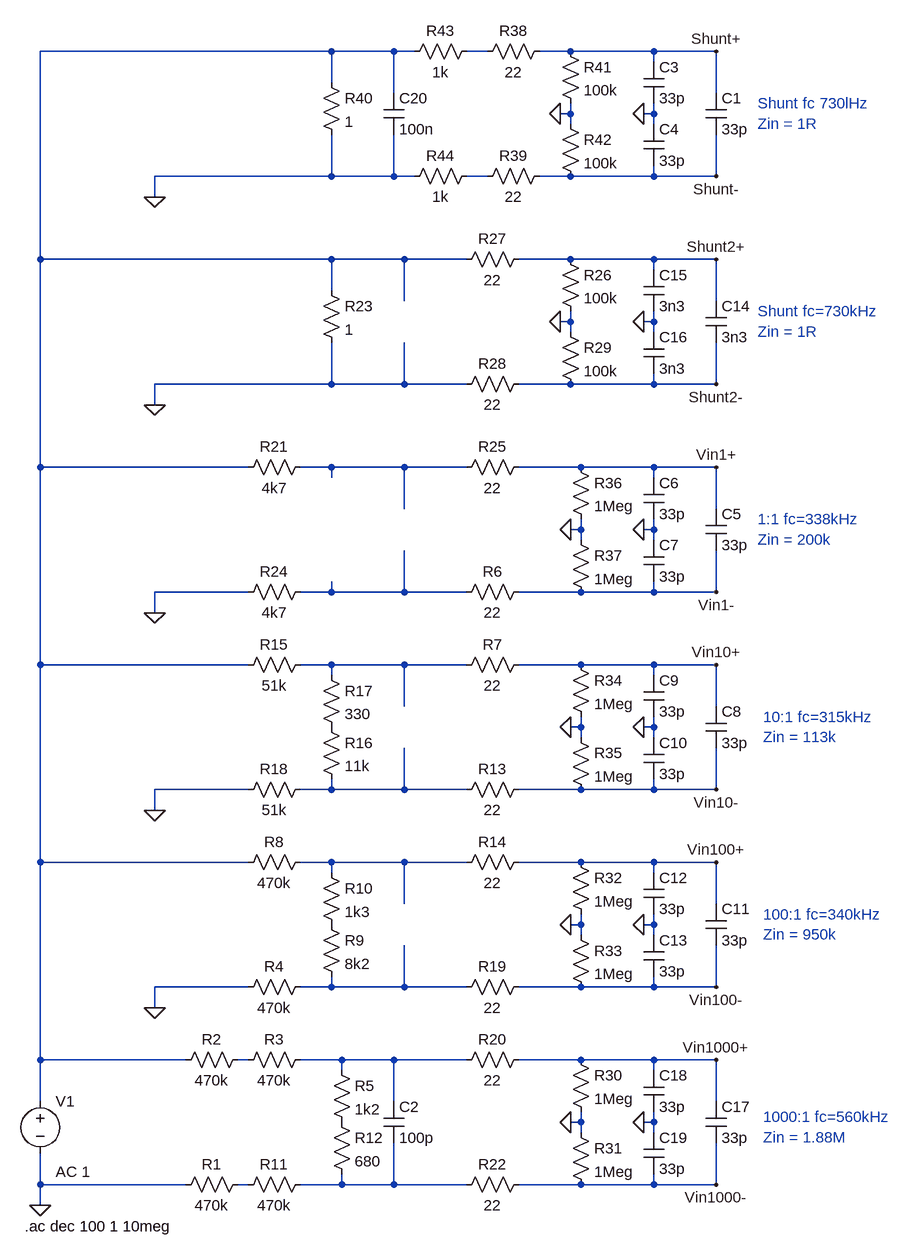
[diagram p0: schematic Input Divider.asc]
Input Divider.asc, the LTspice schematic file:
Version 4.1
SHEET 1 1476 680
WIRE 592 -1472 144 -1472
WIRE 688 -1472 592 -1472
WIRE 720 -1472 688 -1472
WIRE 832 -1472 800 -1472
WIRE 960 -1472 912 -1472
WIRE 1088 -1472 960 -1472
WIRE 1184 -1472 1088 -1472
WIRE 1088 -1456 1088 -1472
WIRE 592 -1424 592 -1472
WIRE 688 -1408 688 -1472
WIRE 1184 -1408 1184 -1472
WIRE 960 -1376 960 -1392
WIRE 960 -1376 944 -1376
WIRE 1088 -1376 1088 -1392
WIRE 1088 -1376 1072 -1376
WIRE 960 -1360 960 -1376
WIRE 1088 -1360 1088 -1376
WIRE 592 -1280 592 -1344
WIRE 592 -1280 320 -1280
WIRE 688 -1280 688 -1344
WIRE 688 -1280 592 -1280
WIRE 720 -1280 688 -1280
WIRE 832 -1280 800 -1280
WIRE 960 -1280 912 -1280
WIRE 1088 -1280 1088 -1296
WIRE 1088 -1280 960 -1280
WIRE 1184 -1280 1184 -1344
WIRE 1184 -1280 1088 -1280
WIRE 320 -1248 320 -1280
WIRE 144 -1152 144 -1472
WIRE 592 -1152 144 -1152
WIRE 704 -1152 592 -1152
WIRE 800 -1152 704 -1152
WIRE 960 -1152 880 -1152
WIRE 1088 -1152 960 -1152
WIRE 1184 -1152 1088 -1152
WIRE 1088 -1136 1088 -1152
WIRE 592 -1104 592 -1152
WIRE 704 -1088 704 -1152
WIRE 1184 -1088 1184 -1152
WIRE 960 -1056 960 -1072
WIRE 960 -1056 944 -1056
WIRE 1088 -1056 1088 -1072
WIRE 1088 -1056 1072 -1056
WIRE 960 -1040 960 -1056
WIRE 1088 -1040 1088 -1056
WIRE 592 -960 592 -1024
WIRE 592 -960 320 -960
WIRE 704 -960 704 -1024
WIRE 704 -960 592 -960
WIRE 800 -960 704 -960
WIRE 960 -960 880 -960
WIRE 1088 -960 1088 -976
WIRE 1088 -960 960 -960
WIRE 1184 -960 1184 -1024
WIRE 1184 -960 1088 -960
WIRE 320 -928 320 -960
WIRE 144 -832 144 -1152
WIRE 464 -832 144 -832
WIRE 592 -832 544 -832
WIRE 704 -832 592 -832
WIRE 800 -832 704 -832
WIRE 976 -832 880 -832
WIRE 1088 -832 976 -832
WIRE 1184 -832 1088 -832
WIRE 592 -816 592 -832
WIRE 1088 -816 1088 -832
WIRE 704 -768 704 -832
WIRE 1184 -768 1184 -832
WIRE 976 -736 976 -752
WIRE 976 -736 960 -736
WIRE 1088 -736 1088 -752
WIRE 1088 -736 1072 -736
WIRE 976 -720 976 -736
WIRE 1088 -720 1088 -736
WIRE 464 -640 320 -640
WIRE 592 -640 592 -656
WIRE 592 -640 544 -640
WIRE 704 -640 704 -704
WIRE 704 -640 592 -640
WIRE 800 -640 704 -640
WIRE 976 -640 880 -640
WIRE 1088 -640 1088 -656
WIRE 1088 -640 976 -640
WIRE 1184 -640 1184 -704
WIRE 1184 -640 1088 -640
WIRE 320 -608 320 -640
WIRE 144 -528 144 -832
WIRE 464 -528 144 -528
WIRE 592 -528 544 -528
WIRE 704 -528 592 -528
WIRE 800 -528 704 -528
WIRE 976 -528 880 -528
WIRE 1088 -528 976 -528
WIRE 1184 -528 1088 -528
WIRE 592 -512 592 -528
WIRE 1088 -512 1088 -528
WIRE 704 -464 704 -528
WIRE 1184 -464 1184 -528
WIRE 976 -432 976 -448
WIRE 976 -432 960 -432
WIRE 1088 -432 1088 -448
WIRE 1088 -432 1072 -432
WIRE 976 -416 976 -432
WIRE 1088 -416 1088 -432
WIRE 464 -336 320 -336
WIRE 592 -336 592 -352
WIRE 592 -336 544 -336
WIRE 704 -336 704 -400
WIRE 704 -336 592 -336
WIRE 800 -336 704 -336
WIRE 976 -336 880 -336
WIRE 1088 -336 1088 -352
WIRE 1088 -336 976 -336
WIRE 1184 -336 1184 -400
WIRE 1184 -336 1088 -336
WIRE 320 -304 320 -336
WIRE 144 -224 144 -528
WIRE 464 -224 144 -224
WIRE 592 -224 544 -224
WIRE 704 -224 592 -224
WIRE 800 -224 704 -224
WIRE 976 -224 880 -224
WIRE 1088 -224 976 -224
WIRE 1184 -224 1088 -224
WIRE 592 -208 592 -224
WIRE 1088 -208 1088 -224
WIRE 704 -160 704 -224
WIRE 1184 -160 1184 -224
WIRE 976 -128 976 -144
WIRE 976 -128 960 -128
WIRE 1088 -128 1088 -144
WIRE 1088 -128 1072 -128
WIRE 976 -112 976 -128
WIRE 1088 -112 1088 -128
WIRE 464 -32 320 -32
WIRE 592 -32 592 -48
WIRE 592 -32 544 -32
WIRE 704 -32 704 -96
WIRE 704 -32 592 -32
WIRE 800 -32 704 -32
WIRE 976 -32 880 -32
WIRE 1088 -32 1088 -48
WIRE 1088 -32 976 -32
WIRE 1184 -32 1184 -96
WIRE 1184 -32 1088 -32
WIRE 320 0 320 -32
WIRE 144 80 144 -224
WIRE 368 80 144 80
WIRE 464 80 448 80
WIRE 608 80 544 80
WIRE 688 80 608 80
WIRE 800 80 688 80
WIRE 976 80 880 80
WIRE 1088 80 976 80
WIRE 1184 80 1088 80
WIRE 608 96 608 80
WIRE 1088 96 1088 80
WIRE 144 144 144 80
WIRE 688 144 688 80
WIRE 1184 144 1184 80
WIRE 976 176 976 160
WIRE 976 176 960 176
WIRE 1088 176 1088 160
WIRE 1088 176 1072 176
WIRE 976 192 976 176
WIRE 1088 192 1088 176
WIRE 144 272 144 224
WIRE 368 272 144 272
WIRE 464 272 448 272
WIRE 608 272 608 256
WIRE 608 272 544 272
WIRE 688 272 688 208
WIRE 688 272 608 272
WIRE 800 272 688 272
WIRE 976 272 880 272
WIRE 1088 272 1088 256
WIRE 1088 272 976 272
WIRE 1184 272 1184 208
WIRE 1184 272 1088 272
WIRE 144 304 144 272
FLAG 144 304 0
FLAG 1184 80 Vin1000+
FLAG 1184 272 Vin1000-
FLAG 320 0 0
FLAG 1184 -224 Vin100+
FLAG 1184 -32 Vin100-
FLAG 320 -304 0
FLAG 1184 -528 Vin10+
FLAG 1184 -336 Vin10-
FLAG 320 -608 0
FLAG 1184 -832 Vin1+
FLAG 1184 -640 Vin1-
FLAG 320 -928 0
FLAG 1184 -1152 Shunt2+
FLAG 1184 -960 Shunt2-
FLAG 1072 -1056 0
FLAG 944 -1056 0
FLAG 960 176 0
FLAG 960 -128 0
FLAG 960 -432 0
FLAG 960 -736 0
FLAG 320 -1248 0
FLAG 1184 -1472 Shunt+
FLAG 1184 -1280 Shunt-
FLAG 1072 -1376 0
FLAG 944 -1376 0
FLAG 1072 -736 0
FLAG 1072 -432 0
FLAG 1072 -128 0
FLAG 1072 176 0
SYMBOL voltage 144 128 R0
WINDOW 123 24 124 Left 2
WINDOW 39 0 0 Left 0
SYMATTR Value2 AC 1
SYMATTR InstName V1
SYMATTR Value ""
SYMBOL res 464 64 R90
WINDOW 0 0 56 VBottom 2
WINDOW 3 32 56 VTop 2
SYMATTR InstName R2
SYMATTR Value 470k
SYMBOL res 560 64 R90
WINDOW 0 0 56 VBottom 2
WINDOW 3 32 56 VTop 2
SYMATTR InstName R3
SYMATTR Value 470k
SYMBOL res 560 -240 R90
WINDOW 0 0 56 VBottom 2
WINDOW 3 32 56 VTop 2
SYMATTR InstName R8
SYMATTR Value 470k
SYMBOL res 576 -144 R0
SYMATTR InstName R9
SYMATTR Value 8k2
SYMBOL res 576 -224 R0
SYMATTR InstName R10
SYMATTR Value 1k3
SYMBOL cap 672 144 R0
SYMATTR InstName C2
SYMATTR Value 100p
SYMBOL res 464 256 R90
WINDOW 0 0 56 VBottom 2
WINDOW 3 32 56 VTop 2
SYMATTR InstName R1
SYMATTR Value 470k
SYMBOL res 560 256 R90
WINDOW 0 0 56 VBottom 2
WINDOW 3 32 56 VTop 2
SYMATTR InstName R11
SYMATTR Value 470k
SYMBOL res 560 -48 R90
WINDOW 0 0 56 VBottom 2
WINDOW 3 32 56 VTop 2
SYMATTR InstName R4
SYMATTR Value 470k
SYMBOL res 592 80 R0
SYMATTR InstName R5
SYMATTR Value 1k2
SYMBOL res 592 160 R0
SYMATTR InstName R12
SYMATTR Value 680
SYMBOL res 560 -544 R90
WINDOW 0 0 56 VBottom 2
WINDOW 3 32 56 VTop 2
SYMATTR InstName R15
SYMATTR Value 51k
SYMBOL res 576 -448 R0
SYMATTR InstName R16
SYMATTR Value 11k
SYMBOL res 576 -528 R0
SYMATTR InstName R17
SYMATTR Value 330
SYMBOL res 560 -352 R90
WINDOW 0 0 56 VBottom 2
WINDOW 3 32 56 VTop 2
SYMATTR InstName R18
SYMATTR Value 51k
SYMBOL res 560 -848 R90
WINDOW 0 0 56 VBottom 2
WINDOW 3 32 56 VTop 2
SYMATTR InstName R21
SYMATTR Value 4k7
SYMBOL res 560 -656 R90
WINDOW 0 0 56 VBottom 2
WINDOW 3 32 56 VTop 2
SYMATTR InstName R24
SYMATTR Value 4k7
SYMBOL res 896 -848 R90
WINDOW 0 0 56 VBottom 2
WINDOW 3 32 56 VTop 2
SYMATTR InstName R25
SYMATTR Value 22
SYMBOL res 896 -656 R90
WINDOW 0 0 56 VBottom 2
WINDOW 3 32 56 VTop 2
SYMATTR InstName R6
SYMATTR Value 22
SYMBOL res 896 -544 R90
WINDOW 0 0 56 VBottom 2
WINDOW 3 32 56 VTop 2
SYMATTR InstName R7
SYMATTR Value 22
SYMBOL res 896 -352 R90
WINDOW 0 0 56 VBottom 2
WINDOW 3 32 56 VTop 2
SYMATTR InstName R13
SYMATTR Value 22
SYMBOL res 896 -240 R90
WINDOW 0 0 56 VBottom 2
WINDOW 3 32 56 VTop 2
SYMATTR InstName R14
SYMATTR Value 22
SYMBOL res 896 -48 R90
WINDOW 0 0 56 VBottom 2
WINDOW 3 32 56 VTop 2
SYMATTR InstName R19
SYMATTR Value 22
SYMBOL res 896 64 R90
WINDOW 0 0 56 VBottom 2
WINDOW 3 32 56 VTop 2
SYMATTR InstName R20
SYMATTR Value 22
SYMBOL res 896 256 R90
WINDOW 0 0 56 VBottom 2
WINDOW 3 32 56 VTop 2
SYMATTR InstName R22
SYMATTR Value 22
SYMBOL cap 1168 -1088 R0
SYMATTR InstName C14
SYMATTR Value 3n3
SYMBOL res 896 -1168 R90
WINDOW 0 0 56 VBottom 2
WINDOW 3 32 56 VTop 2
SYMATTR InstName R27
SYMATTR Value 22
SYMBOL res 896 -976 R90
WINDOW 0 0 56 VBottom 2
WINDOW 3 32 56 VTop 2
SYMATTR InstName R28
SYMATTR Value 22
SYMBOL cap 1072 -1136 R0
SYMATTR InstName C15
SYMATTR Value 3n3
SYMBOL cap 1072 -1040 R0
SYMATTR InstName C16
SYMATTR Value 3n3
SYMBOL res 576 -1120 R0
SYMATTR InstName R23
SYMATTR Value 1
SYMBOL res 944 -1168 R0
SYMATTR InstName R26
SYMATTR Value 100k
SYMBOL res 944 -1056 R0
SYMATTR InstName R29
SYMATTR Value 100k
SYMBOL res 960 64 R0
SYMATTR InstName R30
SYMATTR Value 1Meg
SYMBOL res 960 176 R0
SYMATTR InstName R31
SYMATTR Value 1Meg
SYMBOL res 960 -240 R0
SYMATTR InstName R32
SYMATTR Value 1Meg
SYMBOL res 960 -128 R0
SYMATTR InstName R33
SYMATTR Value 1Meg
SYMBOL res 960 -544 R0
SYMATTR InstName R34
SYMATTR Value 1Meg
SYMBOL res 960 -432 R0
SYMATTR InstName R35
SYMATTR Value 1Meg
SYMBOL res 960 -848 R0
SYMATTR InstName R36
SYMATTR Value 1Meg
SYMBOL res 960 -736 R0
SYMATTR InstName R37
SYMATTR Value 1Meg
SYMBOL res 928 -1488 R90
WINDOW 0 0 56 VBottom 2
WINDOW 3 32 56 VTop 2
SYMATTR InstName R38
SYMATTR Value 22
SYMBOL res 928 -1296 R90
WINDOW 0 0 56 VBottom 2
WINDOW 3 32 56 VTop 2
SYMATTR InstName R39
SYMATTR Value 22
SYMBOL res 576 -1440 R0
SYMATTR InstName R40
SYMATTR Value 1
SYMBOL res 944 -1488 R0
SYMATTR InstName R41
SYMATTR Value 100k
SYMBOL res 944 -1376 R0
SYMATTR InstName R42
SYMATTR Value 100k
SYMBOL cap 672 -1408 R0
SYMATTR InstName C20
SYMATTR Value 100n
SYMBOL cap 1168 -1408 R0
SYMATTR InstName C1
SYMATTR Value 33p
SYMBOL cap 1072 -1456 R0
SYMATTR InstName C3
SYMATTR Value 33p
SYMBOL cap 1072 -1360 R0
SYMATTR InstName C4
SYMATTR Value 33p
SYMBOL cap 1168 -768 R0
SYMATTR InstName C5
SYMATTR Value 33p
SYMBOL cap 1072 -816 R0
SYMATTR InstName C6
SYMATTR Value 33p
SYMBOL cap 1072 -720 R0
SYMATTR InstName C7
SYMATTR Value 33p
SYMBOL cap 1168 -464 R0
SYMATTR InstName C8
SYMATTR Value 33p
SYMBOL cap 1072 -512 R0
SYMATTR InstName C9
SYMATTR Value 33p
SYMBOL cap 1072 -416 R0
SYMATTR InstName C10
SYMATTR Value 33p
SYMBOL cap 1168 -160 R0
SYMATTR InstName C11
SYMATTR Value 33p
SYMBOL cap 1072 -208 R0
SYMATTR InstName C12
SYMATTR Value 33p
SYMBOL cap 1072 -112 R0
SYMATTR InstName C13
SYMATTR Value 33p
SYMBOL cap 1168 144 R0
SYMATTR InstName C17
SYMATTR Value 33p
SYMBOL cap 1072 96 R0
SYMATTR InstName C18
SYMATTR Value 33p
SYMBOL cap 1072 192 R0
SYMATTR InstName C19
SYMATTR Value 33p
SYMBOL res 816 -1488 R90
WINDOW 0 0 56 VBottom 2
WINDOW 3 32 56 VTop 2
SYMATTR InstName R43
SYMATTR Value 1k
SYMBOL res 816 -1296 R90
WINDOW 0 0 56 VBottom 2
WINDOW 3 32 56 VTop 2
SYMATTR InstName R44
SYMATTR Value 1k
TEXT 120 336 Left 2 !.ac dec 100 1 10meg
TEXT 1256 168 Left 2 ;1000:1 fc=560kHz\nZin = 1.88M
TEXT 1256 -144 Left 2 ;100:1 fc=340kHz\nZin = 950k
TEXT 1256 -448 Left 2 ;10:1 fc=315kHz\nZin = 113k
TEXT 1248 -752 Left 2 ;1:1 fc=338kHz\nZin = 200k
TEXT 1248 -1072 Left 2 ;Shunt fc=730kHz\nZin = 1R
TEXT 1248 -1392 Left 2 ;Shunt fc 730lHz\nZin = 1R

The netlist it stands for:
* Input Divider.asc
V1 N001 0 AC 1
R2 N010 N001 470k
R3 N011 N010 470k
R8 N008 N001 470k
R9 P001 N009 8k2
R10 N008 P001 1k3
C2 N011 N013 100p
R1 N012 0 470k
R11 N013 N012 470k
R4 N009 0 470k
R5 N011 P002 1k2
R12 P002 N013 680
R15 N006 N001 51k
R16 P003 N007 11k
R17 N006 P003 330
R18 N007 0 51k
R21 N004 N001 4k7
R24 N005 0 4k7
R25 Vin1+ N004 22
R6 Vin1- N005 22
R7 Vin10+ N006 22
R13 Vin10- N007 22
R14 Vin100+ N008 22
R19 Vin100- N009 22
R20 Vin1000+ N011 22
R22 Vin1000- N013 22
C14 Shunt2+ Shunt2- 3n3
R27 Shunt2+ N001 22
R28 Shunt2- 0 22
C15 Shunt2+ 0 3n3
C16 0 Shunt2- 3n3
R23 N001 0 1
R26 Shunt2+ 0 100k
R29 0 Shunt2- 100k
R30 Vin1000+ 0 1Meg
R31 0 Vin1000- 1Meg
R32 Vin100+ 0 1Meg
R33 0 Vin100- 1Meg
R34 Vin10+ 0 1Meg
R35 0 Vin10- 1Meg
R36 Vin1+ 0 1Meg
R37 0 Vin1- 1Meg
R38 Shunt+ N002 22
R39 Shunt- N003 22
R40 N001 0 1
R41 Shunt+ 0 100k
R42 0 Shunt- 100k
C20 N001 0 100n
C1 Shunt+ Shunt- 33p
C3 Shunt+ 0 33p
C4 0 Shunt- 33p
C5 Vin1+ Vin1- 33p
C6 Vin1+ 0 33p
C7 0 Vin1- 33p
C8 Vin10+ Vin10- 33p
C9 Vin10+ 0 33p
C10 0 Vin10- 33p
C11 Vin100+ Vin100- 33p
C12 Vin100+ 0 33p
C13 0 Vin100- 33p
C17 Vin1000+ Vin1000- 33p
C18 Vin1000+ 0 33p
C19 0 Vin1000- 33p
R43 N002 N001 1k
R44 N003 0 1k
.ac dec 100 1 10meg
* 1000:1 fc=560kHz
* Zin = 1.88M
* 100:1 fc=340kHz
* Zin = 950k
* 10:1 fc=315kHz
* Zin = 113k
* 1:1 fc=338kHz
* Zin = 200k
* Shunt fc=730kHz
* Zin = 1R
* Shunt fc 730lHz
* Zin = 1R
.backanno
.end